# EasyEDA schematic SCH_BLE-Watch.json
TITLE: Sheet_1; REV: 1.0; Date: 2021-03-22; Sheet: 1/1; Drawn By: usairemalamgeerbemts; Company: Quickgen Technologies PK
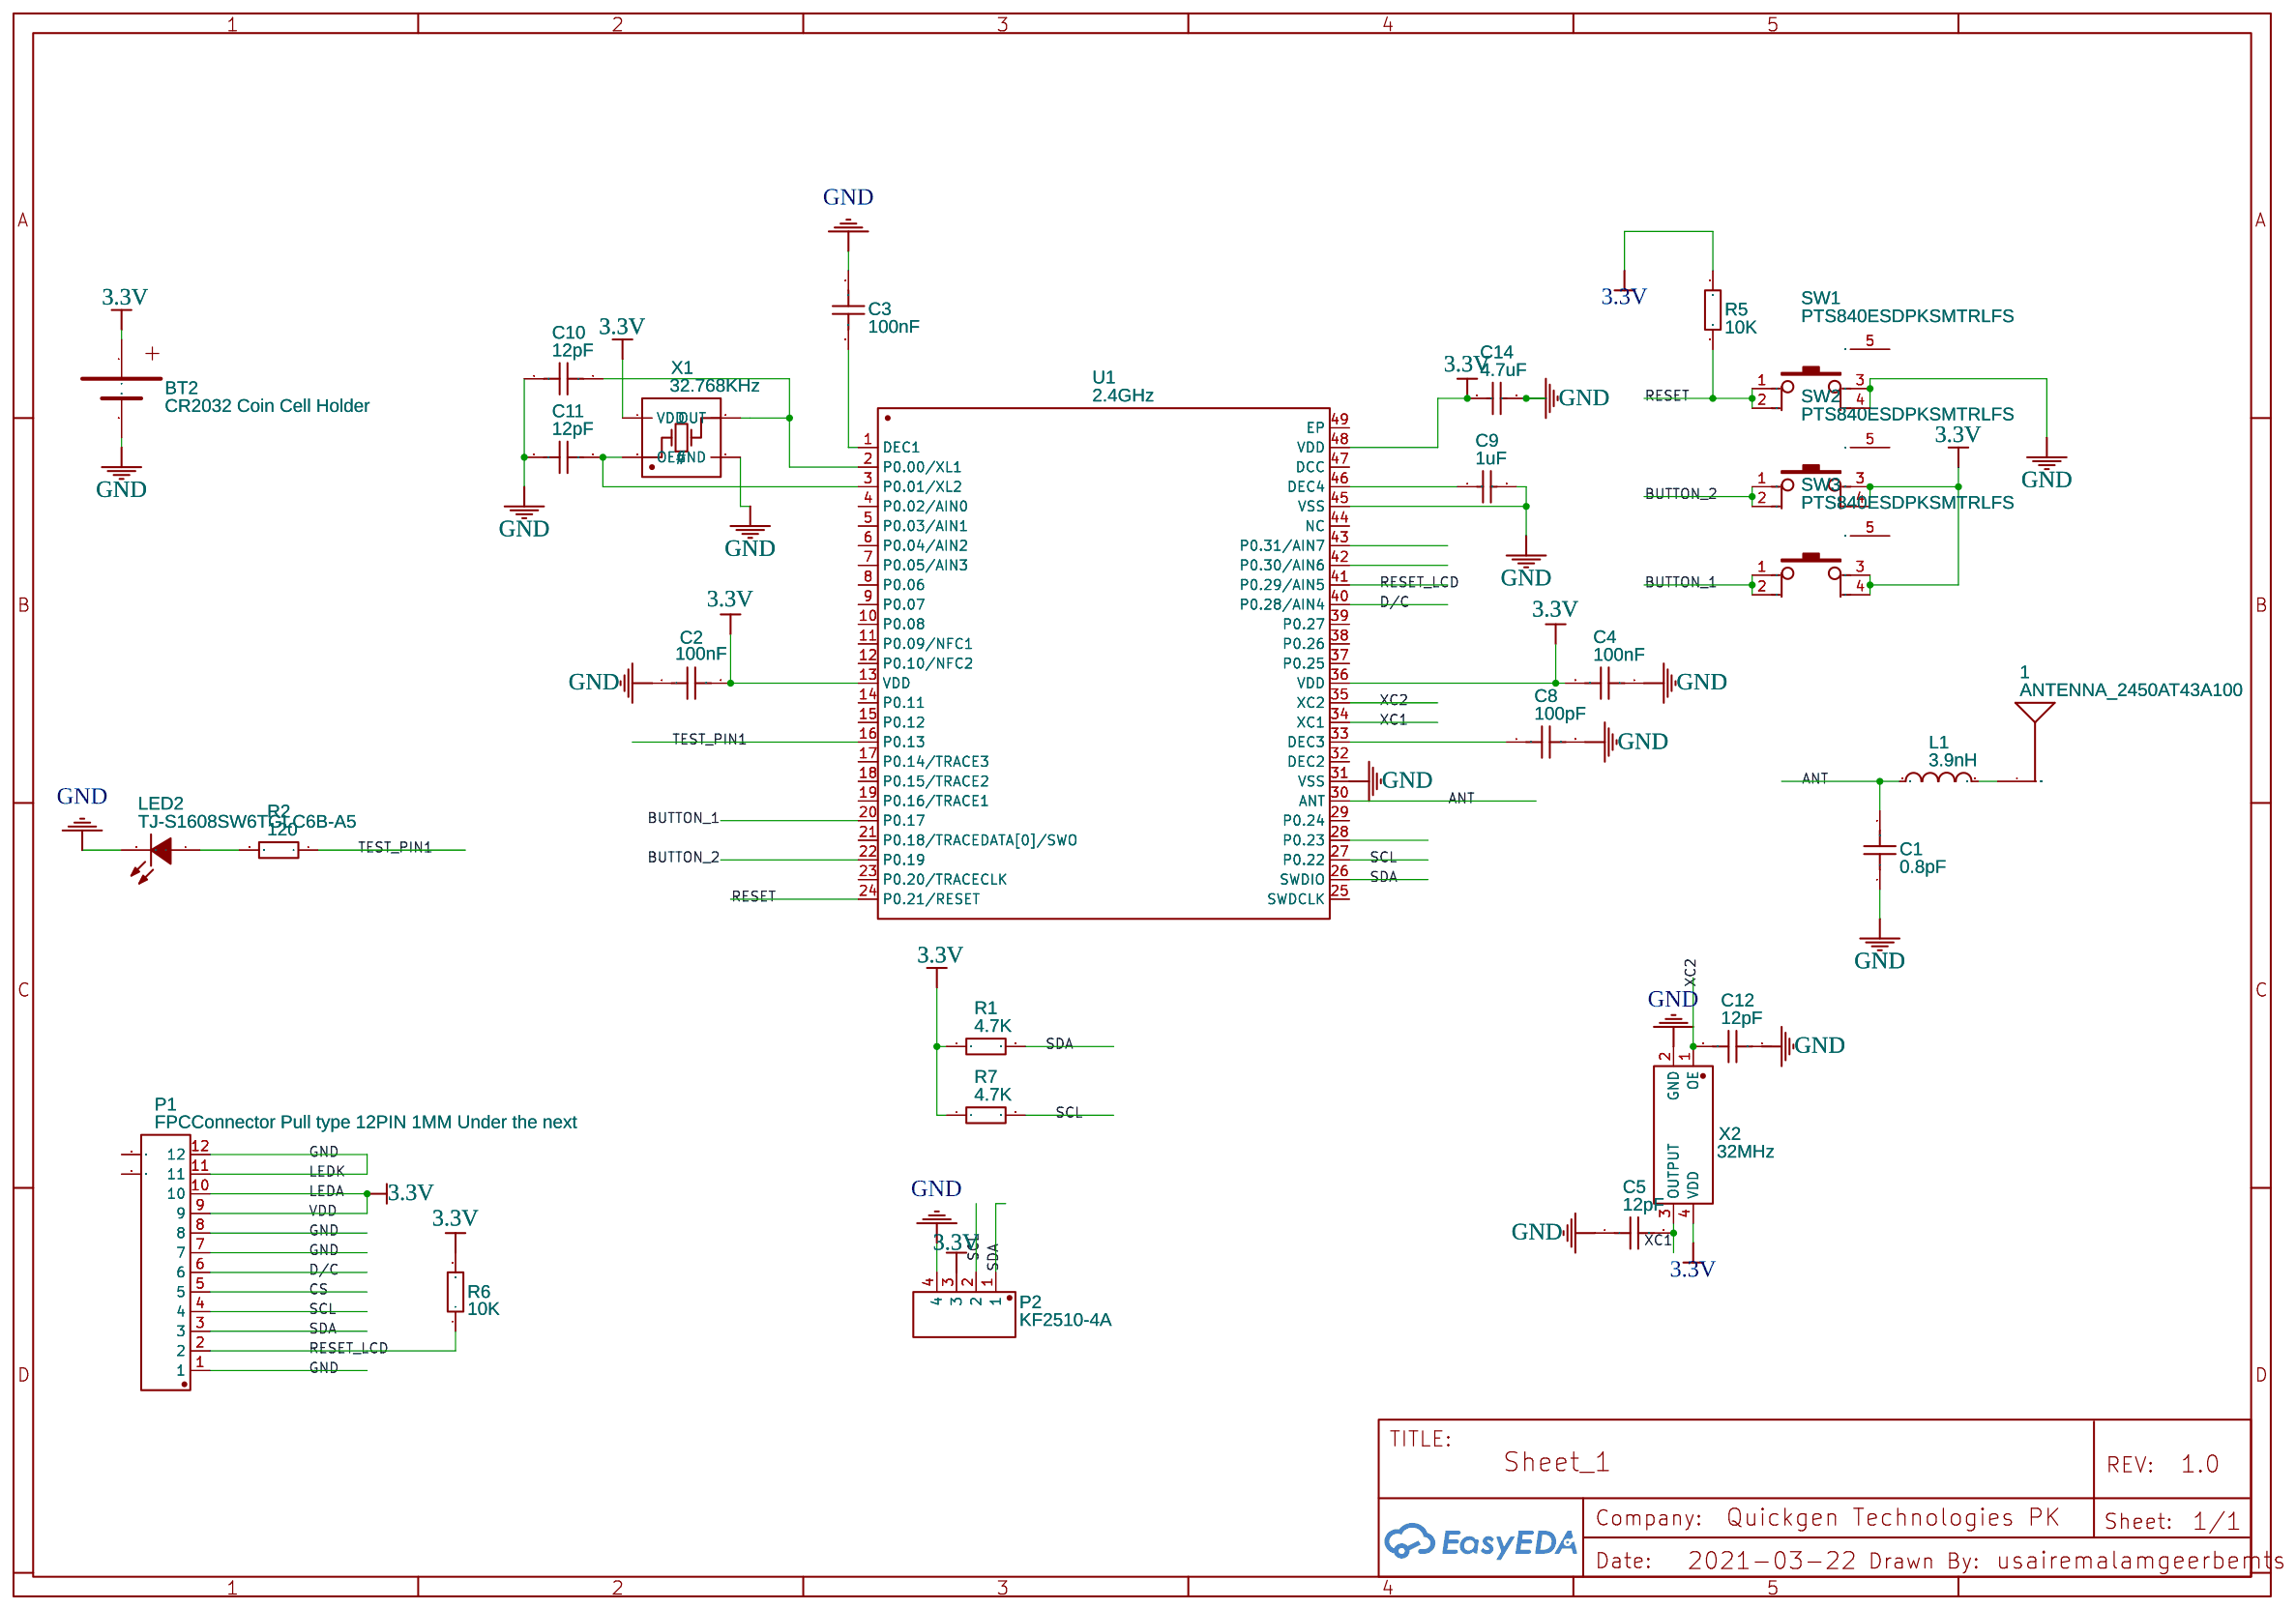
[diagram p0: schematic sheet]

## Parts
1  ANTENNA_2450AT43A100  [ANTENNA-SMD-7MM]
BT2  CR2032 Coin Cell Holder  [CR2025]
C1  0.8pF  [C0402]
C2  100nF  [C0402]
C3  100nF  [C0402]
C4  100nF  [C0402]
C5  12pF  [C0402]
C8  100pF  [C0402]
C9  1uF  [C0603]
C10  12pF  [C0402]
C11  12pF  [C0402]
C12  12pF  [C0402]
C14  4.7uF  [C0603]
L1  3.9nH  [L0402]
LED2  TJ-S1608SW6TGLC6B-A5  [LED0603-R-RD]
P1  FPCConnector Pull type 12PIN 1MM Under the next  [FPC-SMD_AFA07-S12FCC-00]
P2  KF2510-4A  [CONN-TH_4P-P2.54_KF2510-4A]
R1  4.7K  [R0402]
R2  120  [R0402]
R5  10K  [R0402]
R6  10K  [R0402]
R7  4.7K  [R0402]
SW1  PTS840ESDPKSMTRLFS  [SW-SMD_4P_PTS840ESDGKPSMTRLFS_DIP_ZC]
SW2  PTS840ESDPKSMTRLFS  [SW-SMD_4P_PTS840ESDGKPSMTRLFS_DIP_ZC]
SW3  PTS840ESDPKSMTRLFS  [SW-SMD_4P_PTS840ESDGKPSMTRLFS_DIP_ZC]
U1  2.4GHz  [QFN-48_L6.0-W6.0-P0.40-BL-EP3.8]
X1  32.768KHz  [OSC-SMD_4P-L3.2-W2.5-BL]
X2  32MHz  [OSC-SMD_4P-L5.0-W3.2-BL_SG5032]

## Library data of the parts
1 = ANTENNA_2450AT43A100: Contributor: Vaibhav Pawar
BT2 = CR2032 Coin Cell Holder: Manufacturer Part: BS-7 (2032 Coin Cell Holder); Supplier Part: BS-7-ND; Supplier: Digi-Key; link: http://www.memoryprotectiondevices.com/datasheets/BS-7-datasheet.pdf; Contributor: HEOL_Digital_Works
C1 = CC0402BRNPO9BNR80: Supplier: LCSC; Supplier Part: C327032; Manufacturer: YAGEO; Contributor: LCSC
C2-C4 = CC0402KRX7R7BB104: Supplier: LCSC; Manufacturer: YAGEO; Supplier Part: C60474
C5 C10-C12 = 0402N120G500CT: Supplier: LCSC; Supplier Part: C340649; Manufacturer: Walsin Tech Corp; Contributor: LCSC
C8 = C1005NPO101JGT: Supplier: LCSC; Supplier Part: C258507; Manufacturer: Darfon Elec; Contributor: LCSC
C9 = CC0603KRX7R7BB105: Supplier: LCSC; Manufacturer: YAGEO; Supplier Part: C106248
C14 = CC0603KRX5R6BB475: Supplier: LCSC; Manufacturer: YAGEO; Supplier Part: C109456
L1 = SDWL1005C3N9JSTF: Supplier: LCSC; Supplier Part: C370307; Manufacturer: Sunlord; Contributor: LCSC
LED2 = TJ-S1608SW6TGLC6B-A5: Supplier: LCSC; Supplier Part: C192317; Manufacturer: TOGIALED; Contributor: LCSC
P1 = FPCConnector Pull type 12PIN 1MM Under the next: Supplier: LCSC; Manufacturer: ReliaPro; Supplier Part: C14431; JLCPCB Part Class: Extended Part
P2 = KF2510-4A: Supplier Part: C27542; Supplier: LCSC; Manufacturer: ReliaPro
R1 R7 = RMS04JT472: Supplier: LCSC; Supplier Part: C208992; Manufacturer: TA-I Tech; Contributor: LCSC; JLCPCB Part Class: Extended Part
R2 = RMC04021201%N: Supplier: LCSC; Supplier Part: C325379; Manufacturer: Tyohm; Contributor: LCSC
R5 = 0402WGF1002TCE: Supplier: LCSC; Manufacturer: UniOhm; Supplier Part: C25744; SMT Type: Basic; JLCPCB SMD: Yes; LCSC Assembly: Yes; Paste Type: base
R6 = TC0225B1002TCE: Supplier: LCSC; Supplier Part: C84351; Manufacturer: Uniroyal Elec; Contributor: LCSC; SMT Type: Extend; JLCPCB SMD: Yes; LCSC Assembly: Yes; Paste Type: expand
SW1-SW3 = PTS840ESDPKSMTRLFS: Supplier: LCSC; Supplier Part: C225080; Manufacturer: C&K; Contributor: LCSC
U1 = NRF52832-QFAA-R: Supplier: LCSC; Manufacturer: NORDIC; Supplier Part: C77540; Paste Type: recommend
X1 = 3N00032G33YC: Supplier: LCSC; Supplier Part: C252344; Manufacturer: SHENZHEN CRYSTAL TECH; Contributor: LCSC
X2 = S5D32.000000B20F30T: Supplier: LCSC; Supplier Part: C387278; Manufacturer: Shenzhen SCTF Elec; Contributor: LCSC

## Nets
3.3V: BT2.1 C2.2 C4.2 C14.2 P1.9 P1.10 P2.3 R1.1 R5.2 R6.2 R7.1 SW2.3 SW2.4 SW3.3 SW3.4 U1.13(VDD) U1.36(VDD) U1.48(VDD) X1.4(VDD) X2.4(VDD)
GND: BT2.2 C1.1 C2.1 C3.1 C4.1 C5.1 C8.2 C9.2 C10.2 C11.2 C12.1 C14.1 LED2.2(K) P1.1 P1.7 P1.8 P1.11 P1.12 P2.4 SW1.3 SW1.4 U1.31(VSS) U1.45(VSS) X1.2(GND) X2.2(GND)
ANT: C1.2 L1.1 U1.30(ANT)
BUTTON_1: SW3.1 SW3.2 U1.20(P0.17)
BUTTON_2: SW2.1 SW2.2 U1.22(P0.19)
CS: P1.5
D/C: P1.6 U1.40(P0.28/AIN4)
RESET: R5.1 SW1.1 SW1.2 U1.24(P0.21/RESET)
RESET_LCD: P1.2 R6.1 U1.41(P0.29/AIN5)
SCL: P1.4 P2.2 R7.2 U1.27(P0.22)
SDA: P1.3 P2.1 R1.2 U1.26(SWDIO)
TEST_PIN1: R2.1 U1.16(P0.13)
XC1: C5.2 U1.34(XC1) X2.3(OUTPUT)
XC2: C12.2 U1.35(XC2) X2.1(OE)
Net-(1-1): 1.1(P$1) L1.2
Net-(C3-2): C3.2 U1.1(DEC1)
Net-(C8-1): C8.1 U1.33(DEC3)
Net-(C9-1): C9.1 U1.46(DEC4)
Net-(C10-1): C10.1 U1.2(P0.00/XL1) X1.3(OUT)
Net-(C11-1): C11.1 U1.3(P0.01/XL2) X1.1(OE#)
Net-(LED2-1): LED2.1(A) R2.2

Not connected (* = marked no-connect by the designer): P1 13 14; SW1 5; SW2 5; SW3 5; U1 4(P0.02/AIN0) 5(P0.03/AIN1) 6(P0.04/AIN2) 7(P0.05/AIN3) 8(P0.06) 9(P0.07) 10(P0.08) 11(P0.09/NFC1) 12(P0.10/NFC2) 14(P0.11) 15(P0.12) 17(P0.14/TRACE3) 18(P0.15/TRACE2) 19(P0.16/TRACE1) 21(P0.18/TRACEDATA[0]/SWO) 23(P0.20/TRACECLK) 25(SWDCLK) 28(P0.23) 29(P0.24) 32(DEC2) 37(P0.25) 38(P0.26) 39(P0.27) 42(P0.30/AIN6) 43(P0.31/AIN7) 44(NC) 47(DCC) 49(EP)
